# Altium schematic sheet Poactuator_Microcontroller.SchDoc: Sample Sheet Title
size B; Date: MM/DD/YYYY; Author: Sample Author; Organization: ORGANIZATION; Address1: ADDRESS 1; Address2: ADDRESS 2; Address3: ADDRESS 3; Address4: ADDRESS 4; Revision: -; SheetNumber: 3; SheetTotal: 8; ENG_APP_DATE: --/--/--; DSN_APP_DATE: --/--/--; CHK_APP_DATE: --/--/--
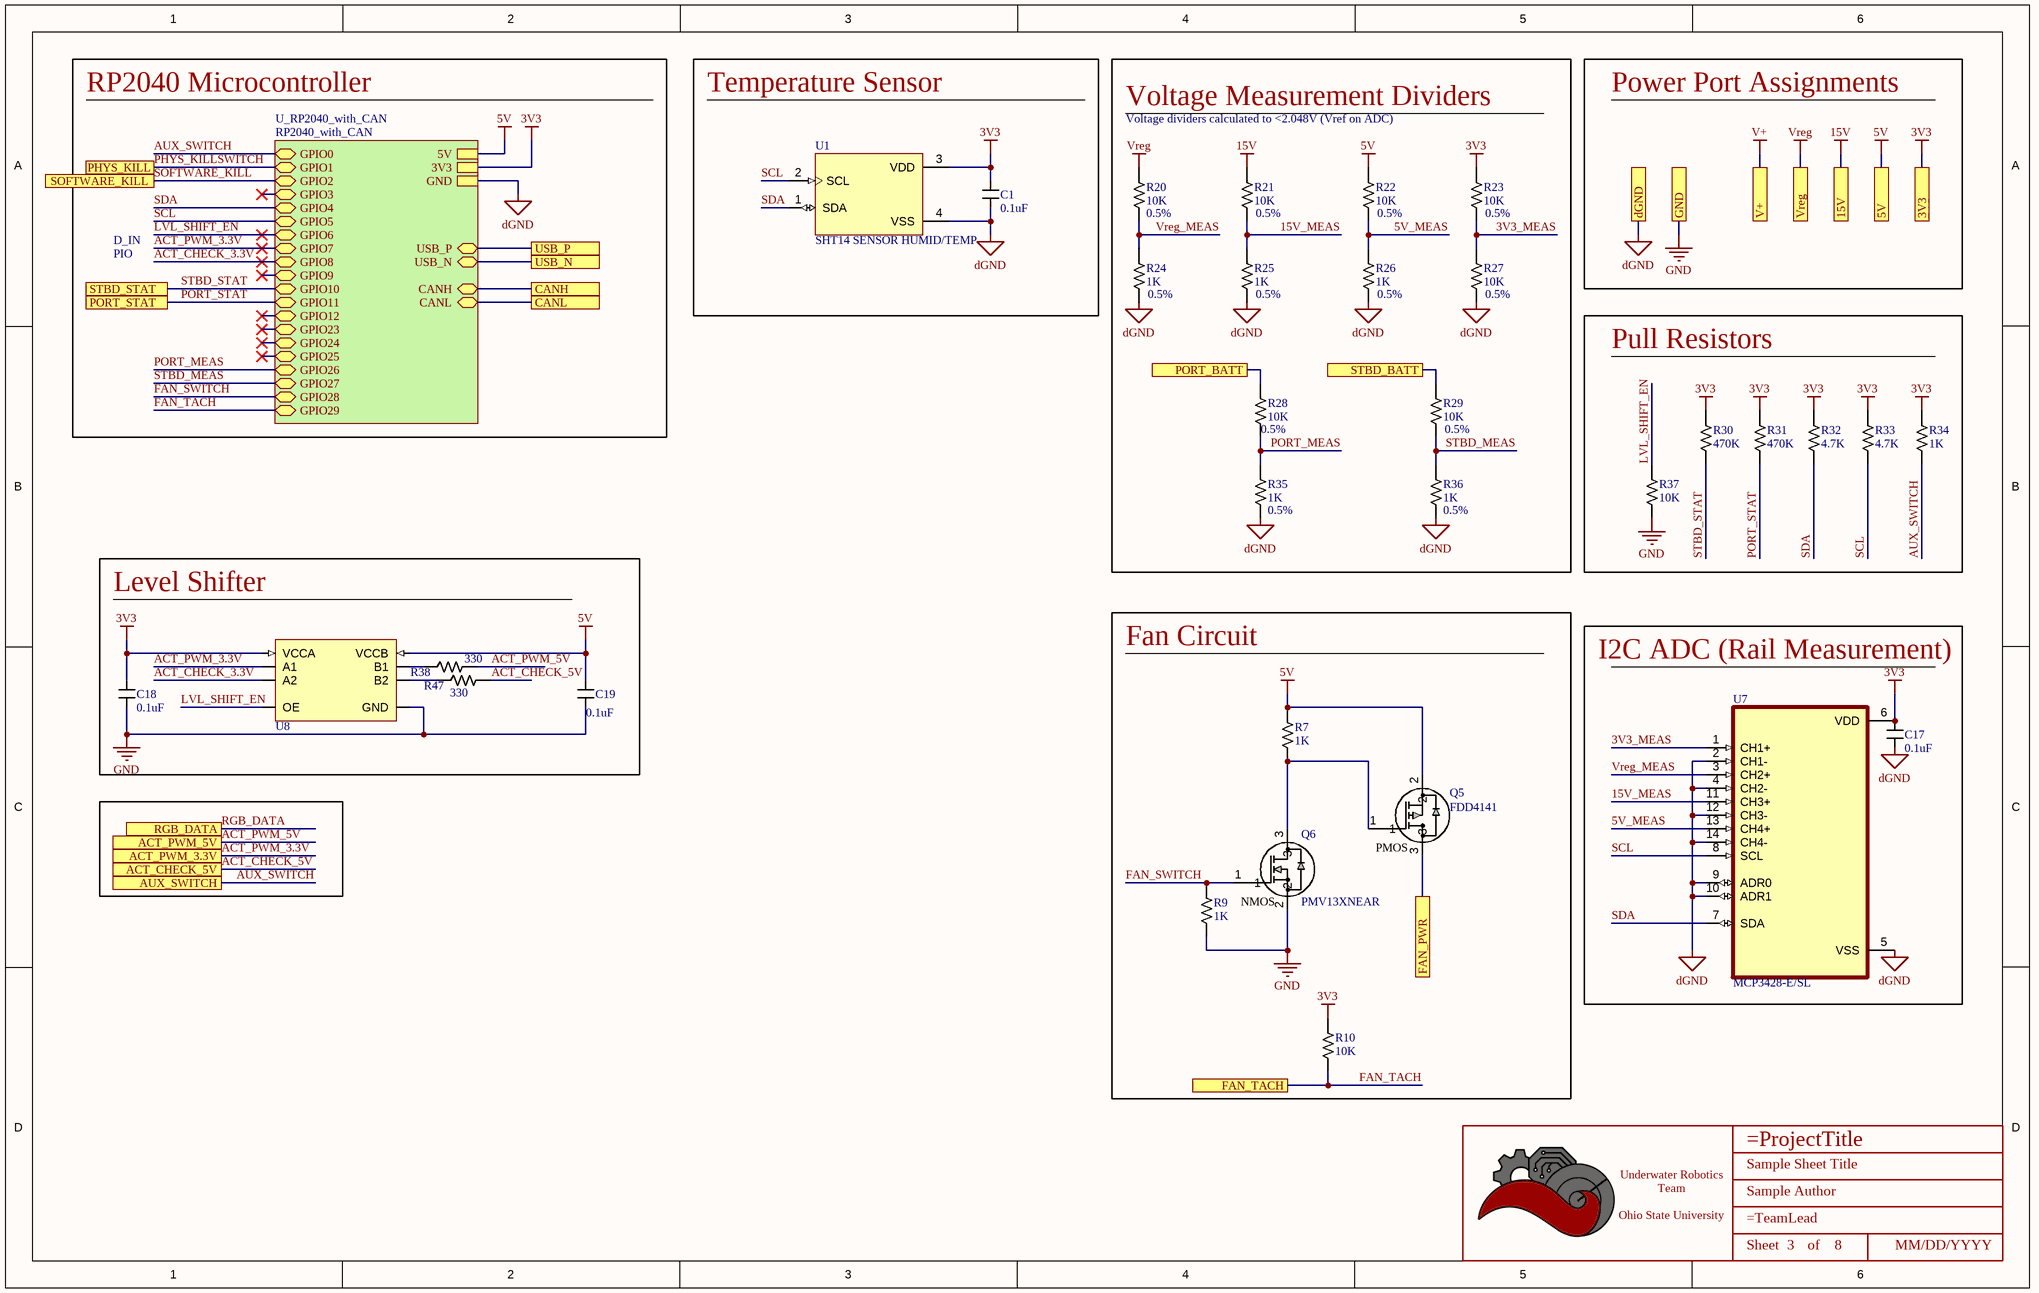
[diagram p0: Poactuator_Microcontroller.SchDoc]

## Parts
*  Title_Block  [LOGO]  (value not drawn)  (graphical)
C1  value 0.1uF  [CAPACITOR_0603]  (hidden comment: 100nF Ceramic 6.3V)
C17  value 0.1uF  [CAPACITOR_0603]  (hidden comment: 100nF Ceramic 6.3V)
C18  value 0.1uF  [CAPACITOR_0603]  (hidden comment: 100nF Ceramic 6.3V)
C19  value 0.1uF  [CAPACITOR_0603]  (hidden comment: 100nF Ceramic 6.3V)
Q5  FDD4141  [DPAK_ONS]
Q6  PMV13XNEAR  [SOT-23-3]
R7  Value  (Ohms): 1K  [RESISTOR_0603]  (hidden comment: 1k Ohm 5% 1/8W)
R9  Value  (Ohms): 1K  [RESISTOR_0603]  (hidden comment: 1k Ohm 5% 1/8W)
R10  Value  (Ohms): 10K  [RESISTOR_0603]  (hidden comment: 10k Ohm 5% 1/10W)
R20  Value  (Ohms): 10K  [RESISTOR_0603]  (hidden comment: 10k Ohm 0.5% 1/10W)
R21  Value  (Ohms): 10K  [RESISTOR_0603]  (hidden comment: 10k Ohm 0.5% 1/10W)
R22  Value  (Ohms): 10K  [RESISTOR_0603]  (hidden comment: 10k Ohm 0.5% 1/10W)
R23  Value  (Ohms): 10K  [RESISTOR_0603]  (hidden comment: 10k Ohm 0.5% 1/10W)
R24  Value  (Ohms): 1K  [RESISTOR_0603]  (hidden comment: 1k Ohm 5% 1/10W)
R25  Value  (Ohms): 1K  [RESISTOR_0603]  (hidden comment: 1k Ohm 5% 1/10W)
R26  Value  (Ohms): 1K  [RESISTOR_0603]  (hidden comment: 1k Ohm 5% 1/10W)
R27  Value  (Ohms): 10K  [RESISTOR_0603]  (hidden comment: 10k Ohm 0.5% 1/10W)
R28  Value  (Ohms): 10K  [RESISTOR_0603]  (hidden comment: 10k Ohm 0.5% 1/10W)
R29  Value  (Ohms): 10K  [RESISTOR_0603]  (hidden comment: 10k Ohm 0.5% 1/10W)
R30  Value  (Ohms): 470K  [RESISTOR_0603]  (hidden comment: 470k Ohm 5% 1/10W)
R31  Value  (Ohms): 470K  [RESISTOR_0603]  (hidden comment: 470k Ohm 5% 1/10W)
R32  Value  (Ohms): 4.7K  [RESISTOR_0603]  (hidden comment: 4.7k Ohm 5% 1/10W)
R33  Value  (Ohms): 4.7K  [RESISTOR_0603]  (hidden comment: 4.7k Ohm 5% 1/10W)
R34  Value  (Ohms): 1K  [RESISTOR_0603]  (hidden comment: 1k Ohm 5% 1/8W)
R35  Value  (Ohms): 1K  [RESISTOR_0603]  (hidden comment: 1k Ohm 5% 1/10W)
R36  Value  (Ohms): 1K  [RESISTOR_0603]  (hidden comment: 1k Ohm 5% 1/10W)
R37  Value  (Ohms): 10K  [RESISTOR_0603]  (hidden comment: 10k Ohm 5% 1/10W)
R38  Value  (Ohms): 330  [RESISTOR_0603]  (hidden comment: 330 Ohm 1% 1/10W)
R47  Value  (Ohms): 330  [RESISTOR_0603]  (hidden comment: 330 Ohm 1% 1/10W)
U1  SHT14 SENSOR HUMID/TEMP  [XDCR_SHT41-AD1B-R2]
U7  MCP3428-E/SL  [SOIC127P600X175-14N]
U8  IC TRANSLTR BIDIRECTIONAL 8VSSOP  [TXB0102DCUR]  (value not drawn)

## Blocks framed on the sheet
Temperature Sensor: C1 U1
Pull Resistors: R30-R34 R37
Level Shifter: C18 C19 R38 R47 U8
Fan Circuit: Q5 Q6 R7 R9 R10
I2C ADC (Rail Measurement): C17 U7

## Sub-sheets
U_RP2040_with_CAN = RP2040_with_CAN: USB_P (bidir), USB_N (bidir), 5V, CANH (bidir), CANL (bidir), GPIO0 (bidir), GPIO1 (bidir), GPIO2 (bidir), GPIO3 (bidir), GPIO4 (bidir), GPIO5 (bidir), GPIO6 (bidir), GPIO7 (bidir), GPIO8 (bidir), GPIO9 (bidir), GPIO10 (bidir), GPIO11 (bidir), GPIO12 (bidir), GPIO23 (bidir), GPIO24 (bidir), GPIO25 (bidir), GPIO26 (bidir), GPIO27 (bidir), GPIO28 (bidir), GPIO29 (bidir), 3V3, GND

## Ports
3V3, 5V, 15V, ACT_CHECK_5V, ACT_PWM_3.3V, ACT_PWM_5V, AUX_SWITCH, CANH, CANL, dGND, FAN_PWR, FAN_TACH, GND, PHYS_KILL, PORT_BATT, PORT_STAT, RGB_DATA, SOFTWARE_KILL, STBD_BATT, STBD_STAT, USB_N, USB_P, V+, Vreg

## Nets
3V3: C1.1 C17.1 C18.1 R10.1 R23.1 R30.1 R31.1 R32.1 R33.1 R34.1 U1.3(VDD) U7.6(VDD) U8.1(VCCA) ; port 3V3, sheet U_RP2040_with_CAN/3V3
5V: C19.1 Q5.2 R7.1 R22.1 U8.8(VCCB) ; port 5V, sheet U_RP2040_with_CAN/5V
15V: R21.1 ; port 15V
dGND: C1.2 C17.2 R24.2 R25.2 R26.2 R27.2 R35.2 R36.2 U1.4(VSS) U7.2(CH1-) U7.4(CH2-) U7.5(VSS) U7.9(ADR0) U7.10(ADR1) U7.12(CH3-) U7.14(CH4-) ; port dGND, sheet U_RP2040_with_CAN/GND
GND: C18.2 C19.2 Q6.2 R9.2 R37.2 U8.5(GND) ; port GND
V+: port V+
Vreg: R20.1 ; port Vreg
3V3_MEAS: R23.2 R27.1 U7.1(CH1+)
5V_MEAS: R22.2 R26.1 U7.13(CH4+)
15V_MEAS: R21.2 R25.1 U7.11(CH3+)
ACT_CHECK_3.3V: U8.3(A2) ; sheet U_RP2040_with_CAN/GPIO8
ACT_CHECK_5V: R47.1 ; port ACT_CHECK_5V
ACT_PWM_3.3V: U8.2(A1) ; port ACT_PWM_3.3V, sheet U_RP2040_with_CAN/GPIO7
ACT_PWM_5V: R38.1 ; port ACT_PWM_5V
AUX_SWITCH: R34.2 ; port AUX_SWITCH, sheet U_RP2040_with_CAN/GPIO0
CANH: port CANH, sheet U_RP2040_with_CAN/CANH
CANL: port CANL, sheet U_RP2040_with_CAN/CANL
FAN_PWR: Q5.3 ; port FAN_PWR
FAN_SWITCH: Q6.1 R9.1 ; sheet U_RP2040_with_CAN/GPIO28
FAN_TACH: R10.2 ; port FAN_TACH, sheet U_RP2040_with_CAN/GPIO29
LVL_SHIFT_EN: R37.1 U8.4(OE) ; sheet U_RP2040_with_CAN/GPIO6
PHYS_KILLSWITCH: port PHYS_KILL, sheet U_RP2040_with_CAN/GPIO1
PORT_BATT: R28.1 ; port PORT_BATT
PORT_MEAS: R28.2 R35.1 ; sheet U_RP2040_with_CAN/GPIO26
PORT_STAT: R31.2 ; port PORT_STAT, sheet U_RP2040_with_CAN/GPIO11
RGB_DATA: port RGB_DATA
SCL: R33.2 U1.2(SCL) U7.8(SCL) ; sheet U_RP2040_with_CAN/GPIO5
SDA: R32.2 U1.1(SDA) U7.7(SDA) ; sheet U_RP2040_with_CAN/GPIO4
SOFTWARE_KILL: port SOFTWARE_KILL, sheet U_RP2040_with_CAN/GPIO2
STBD_BATT: R29.1 ; port STBD_BATT
STBD_MEAS: R29.2 R36.1 ; sheet U_RP2040_with_CAN/GPIO27
STBD_STAT: R30.2 ; port STBD_STAT, sheet U_RP2040_with_CAN/GPIO10
USB_N: port USB_N, sheet U_RP2040_with_CAN/USB_N
USB_P: port USB_P, sheet U_RP2040_with_CAN/USB_P
Vreg_MEAS: R20.2 R24.1 U7.3(CH2+)
NetQ5_1: Q5.1 Q6.3 R7.2
NetR38_2: R38.2 U8.7(B1)
NetR47_2: R47.2 U8.6(B2)

## Notes on the sheet
- RP2040 Microcontroller
- Power Port Assignments
- Voltage Measurement Dividers
- Voltage dividers calculated to <2.048V (Vref on ADC)
- (near R20) 0.5%
- (near R21) 0.5%
- (near R22) 0.5%
- (near R23) 0.5%
- D_IN
- PIO
- (near R24) 0.5%
- (near R25) 0.5%
- (near R26) 0.5%
- (near R27) 0.5%
- (near R28) 0.5%
- (near R29) 0.5%
- (near R35) 0.5%
- (near R36) 0.5%
- DWG. NO.
- REV.
- SHT.
- THIS DOCUMENT AND THE DATA DISCLOSED HEREIN OR HEREWITH IS THE PROPERTY OF ALTIUM LIMITED AND MAY BE FREELY DISTRIBUTED IN WHOLE. NO RIGHTS ARE RESERVED OR EXPRESS OR IMPLIED WARANTEE GIVEN.
- REVISION
- DESCRIPTION
- DATE
- APPROVED
- ENG:
- APPROVALS
- PROJECT
- DSN:
- CHK:
- REFERENCE DOCUMENTS
- PROJECT REVISION:
- TITLE
- DOCUMENT REVISION:
- DESIGN ITEM:
- BOM:
- FAB DWG:
- PCB DWG:
- ASSY DWG:
- SCALE:
- SIZE
- B
- CAGE CODE
- FILE NAME
- DWG NO.
- SHEET
- OF
- REV
- (in symbol FDD4141) PMOS
- (in symbol PMV13XNEAR) NMOS
- (in symbol Title_Block) Underwater Robotics Team / Ohio State University; Sheet; of

## Library data of the parts
* = Title_Block: UWRT Schematic Title Block Template / Created June 2021, Dylan Trainor
C1 C17-C19 = CAPACITOR_0.1uF_0603: Cap 100nF 6.3V +/-10% / Ceramic 0603; Made By: Flip B; ComponentLink1Description: Datsheet; ComponentLink1URL: https://www.mouser.com/datasheet/2/212/KEM_C1002_X7R_SMD-1102033.pdf; Tolerance: +/- 10%; Voltage: 6.3V; Supplier 1: Digi-Key; Supplier Part Number 1: 399-15351-1-ND
Q5 = FDD4141: P-Channel 10.8A (Ta), 50A (Tc) 2.4W (Ta), 69W (Tc) Surface Mount D-PAK (TO-252AA); FET Type: P-Channel, Power; Vendor: ON Semiconductor; SourceLibrary: ON_Semiconductor_2020-01-13; Vgs (Max): ±20V; Vgs (th): 3V @ 250µA; Vdss: 40 V; Rds (on): 12.3mOhm @ 12.7A, 10V; Amp Rating: 10.8 A; Package: D-PAK (TO-252AA); Manufacturer_Part_Number: FDD4141; Power Dissipation: 2.4W (Ta), 69W (Tc); Supplier 1: Digi-Key; Supplier Part Number 1: FDD4141CT-ND; Created By: Dylan T
Q6 = PMV13XNEAR: N-Channel 20 V 7.3A (Ta) 610mW (Ta), 8.3W (Tc) Surface Mount TO-236AB; Vendor: Nexperia USA Inc.; SourceLibrary: ON_Semiconductor_2020-01-13; Vgs (Max): +/- 12 V; Vgs (th): 1.3V @ 250uA; Vdss: 20 V; Rds (on): 15mOhm @ 7.3A, 8V; Amp Rating: 7.3 A; FET Type: N-Channel; Package: SOT23-3L; Manufacturer _Part_Number: PMV13XNEAR; Power Dissipation: 610mW (Ta), 8.3W (Tc); Created By: Dylan T; Supplier 1: Mouser; Supplier Part Number 1: 771-PMV13XNEAR
R7 R9 R34 = RESISTOR_1K_0603: RES 1k OHM 5% 1/8W 0603; Tolerance: +/- 5%; Made By: Robert Pafford; ComponentLink1Description: Datasheet; ComponentLink1URL: https://www.bourns.com/docs/product-datasheets/CRxxxxx.pdf; Wattage: 1/8W; Supplier: Digikey; Digikey Part Numer: CR0603-JW-104ELFTR-ND; Supplier 1: Digi-Key; Supplier Part Number 1: 2019-RK73B1JTTD102JCT-ND
R10 R37 = RESISTOR_10K_0603: RES 10k OHM 5% 1/10W 0603; Tolerance: +/- 5%; Wattage: 1/8W; Made By: Robert Pafford; ComponentLink1Description: Datasheet; ComponentLink1URL: https://www.bourns.com/docs/product-datasheets/CRxxxxx.pdf; Supplier: Digikey; Digikey Part Numer: CR0603-JW-104ELFTR-ND; Supplier 1: Digi-Key; Supplier Part Number 1: 2019-RK73B1JTTD103JCT-ND
R20-R23 R27-R29 = RESISTOR_10K_0.5%_0603: RES 10k OHM 0.5% 1/10W 0603; Tolerance: +/- 0.5%; Made By: Robert Pafford; Wattage: 1/10W; Supplier: Digikey; Digikey Part Numer: CR0603-JW-104ELFTR-ND; Supplier 1: Digi-Key; Supplier Part Number 1: 749-1695-1-ND
R24-R26 R35 R36 = RESISTOR_1K_0.5%_0603: RES 1k OHM 0.5% 1/10W 0603; Tolerance: +/- 0.5%; Made By: Robert Pafford; Wattage: 1/10W; Supplier: Digikey; Digikey Part Numer: CR0603-JW-104ELFTR-ND; Supplier 1: Digi-Key; Supplier Part Number 1: 749-1693-1-ND
R30 R31 = RESISTOR_470K_0603: RES 470k OHM 5% 1/10W 0603; Tolerance: +/- 5%; Made By: Robert P; ComponentLink1Description: Datasheet; ComponentLink1URL: https://www.bourns.com/docs/product-datasheets/CRxxxxx.pdf; Wattage: 1/10W; Supplier 1: Digi-Key; Supplier Part Number 1: RMCF0603JT470KCT-ND
R32 R33 = RESISTOR_4.7K_0603: RES 4.7k OHM 5% 1/10W 0603; Tolerance: +/- 5%; Made By: Robert Pafford; Wattage: 1/10W; Supplier: Digikey; Digikey Part Numer: CR0603-JW-104ELFTR-ND; Supplier 1: Digi-Key; Supplier Part Number 1: RMCF0603JT4K70CT-ND
R38 R47 = RESISTOR_330_0603: RES 330 OHM 1% 1/10W 0603; Tolerance: +/- 1%; Made By: Robert Pafford; Wattage: 1/10W; Supplier 1: Digi-Key; Supplier Part Number 1: P330HCT-ND
U1 = SHT41-AD1B-R2: Digital Relative Humidity Temperature Sensor, Â±1.8 / max 2.5 %RH, Â±0.2 Â°C, Ultra-Low-Power; MF: Sensirion; Price: None; SnapEDA_Link: https://www.snapeda.com/parts/SHT41-AD1B-R2/Sensirion/view-part/?ref=snap; MP: SHT41-AD1B-R2; Purchase-URL: https://pricing.snapeda.com/search/part/SHT41-AD1B-R2/?ref=eda; Value: *; Availability: In Stock; Package: None; Check_prices: https://www.snapeda.com/parts/SHT41-AD1B-R2/Sensirion/view-part/?ref=eda; Supplier 1: Digi-Key; Supplier Part Number 1: 1649-SHT41-AD1B-R2CT-ND
U7 = MCP3428-E/SL: 16 Bit Analog to Digital Converter 4 Input 1 Sigma-Delta 14-SOIC; MF: Microchip; Package: SOIC-14 Microchip; SnapEDA_Link: https://www.snapeda.com/parts/MCP3428-E/SL/Microchip/view-part/13249/?ref=snap; MP: MCP3428-E/SL; Price: None; Availability: Unavailable; Value: *
U8 = TXB0102DCUR: Voltage Level Translator Bidirectional 1 Circuit 2 Channel 20Mbps 8-MSOP; Made By: Zach Ramsey; Channels: 2; Voltage Range (VCCA): 1.2 V ~ 3.6 V; Max Rate: 100 Mbps; Voltage Range (VCCB): 1.65 V ~ 5.5 V; Supplier 1: Digi-Key; Supplier Part Number 1: TXB0102DCUR; Channel Type: Bidirectional